# Altium schematic sheet ui_main_board.SchDoc
size A
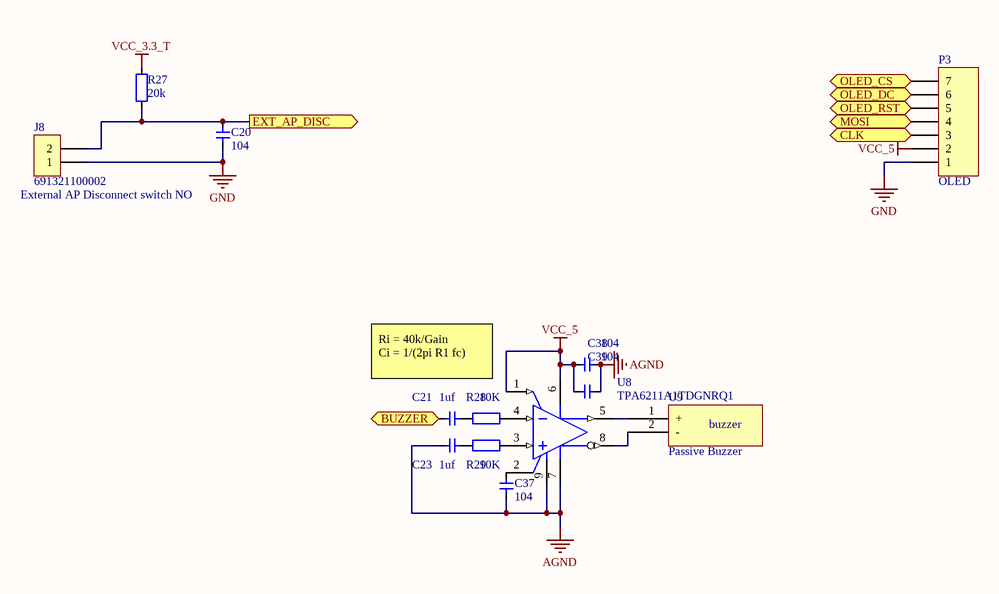
[diagram p0: ui_main_board.SchDoc]

## Parts
C20  value 104  [CAP_0603]  (hidden comment: Cap_0603)
C21  value 1uf  [CAP_0603]  (hidden comment: Cap_0603)
C23  value 1uf  [CAP_0603]  (hidden comment: Cap_0603)
C37  value 104  [CAP_0603]  (hidden comment: Cap_0603)
C38  value 104  [CAP_0603]  (hidden comment: Cap_0603)
C39  value 104  [CAP_0603]  (hidden comment: Cap_0603)
J8  691321100002  [691322110002]
P3  OLED  [HDR1X7]
R27  value 20k  [RES_0603]  (hidden comment: Res_0603)
R28  value 10K  [RES_0603]  (hidden comment: Res_0603)
R29  value 10K  [RES_0603]  (hidden comment: Res_0603)
U8  TPA6211A1TDGNRQ1  [TI-DGN8-1760X1425TP_N]
U9  Passive Buzzer  [62000211121]

## Ports
BUZZER (in), CLK (in), EXT_AP_DISC (out), MOSI (in), OLED_CS (in), OLED_DC (in), OLED_RST (in)

## Nets
AGND: C23.1 C37.2 C38.2 C39.2 U8.7(GND) U8.9(EP)
GND: C20.1 J8.1 P3.1
VCC_3.3_T: R27.2
VCC_5: C38.1 C39.1 P3.2 U8.1(~{SHUTDOWN}) U8.6(VDD)
BUZZER: C21.1 ; port BUZZER
CLK: P3.3 ; port CLK
EXT_AP_DISC: C20.2 J8.2 R27.1 ; port EXT_AP_DISC
MOSI: P3.4 ; port MOSI
OLED_CS: P3.7 ; port OLED_CS
OLED_DC: P3.6 ; port OLED_DC
OLED_RST: P3.5 ; port OLED_RST
NetC21_2: C21.2 R28.1
NetC23_2: C23.2 R29.1
NetC37_1: C37.1 U8.2(BYPASS)
NetR28_2: R28.2 U8.4(IN-)
NetR29_2: R29.2 U8.3(IN+)
NetU8_5: U8.5(VO+) U9.1(+)
NetU8_8: U8.8(VO-) U9.2(-)

## Notes on the sheet
- (near J8) External AP Disconnect switch NO
- Ri = 40k/Gain
  Ci = 1/(2pi R1 fc)
- (in symbol Passive Buzzer) buzzer

## Library data of the parts
C20 C21 C23 C37-C39 = Cap_0603: Capacitor
J8 = 691321100002: WR-TBL Terminal block - serie 3211 - 3.50 mm; Manufacturer: Würth Elektronik eiSos GmbH; ComponentLink1 Description: Manufacturer; ComponentLink2 Description: Datasheet; NoPins: 2; Created Date: 9 December 2013; partNo: 691321100002; ComponentLink1URL: http://www.we-online.com; ComponentLink2URL: http://katalog.we-online.de/em/datasheet/6913211000xx.pdf; Created by: Karrer Zheng
P3 = Header 7: Header, 7-Pin; LatestRevisionDate: 17-Jul-2002; LatestRevisionNote: Re-released for DXP Platform.; Publisher: Altium Limited
R27-R29 = Res_0603: Resistor
U8 = TPA6211A1TDGNRQ1: Automotive Catalog 3.1-W Mono, Fully Differential, Class-AB Audio Amplifier, -40 to 105 degC, 8-pin SOP (DGN8), Green (RoHS & no Sb/Br); Manufacturer: Texas Instruments; Output Power(W): 2.45; PSRR(dB): -85; SubFamily: Dynamic Speaker; Supply Max(Max)(Volt): 5.5; Supply Min(Min)(Volt): 2.5; DatasheetVersion: SBOS555; PackageVersion: 4073271/F, 05/2011; PackageReference: DGN8-1760X1425TP; PackageDescription: 8-Pin Plastic Small Outline, Body 3 x 3 mm, Pitch 0.65 mm; Supplier 1: Digi-Key; Supplier Part Number 1: 296-29059-2-ND; Supplier 2: Digi-Key; Supplier Part Number 2: 296-29059-1-ND; Supplier 3: Digi-Key; Supplier Part Number 3: 296-29059-6-ND; Supplier 4: Mouser; Supplier Part Number 4: 595-TPA6211A1TDGNRQ1; Eco-Plan: Green (RoHS & no Sb/Br); Speaker Amp Type: Class-AB; Speaker Channels: Mono; Mounting Technology: Surface Mount; Code_JEDEC: MO-187; PartNumber: TPA6211A1TDGNRQ1; ComponentLink1Description: Manufacturer URL; ComponentLink1URL: http://www.ti.com/; ComponentLink2Description: Datasheet; ComponentLink2URL: http://www.ti.com/general/docs/lit/getliterature.tsp?genericPartNumber=TPA6211A1-Q1&fileType=pdf; ComponentLink3Description: Package Specification; ComponentLink3URL: http://www.ti.com/litv/pdf/mpds046e